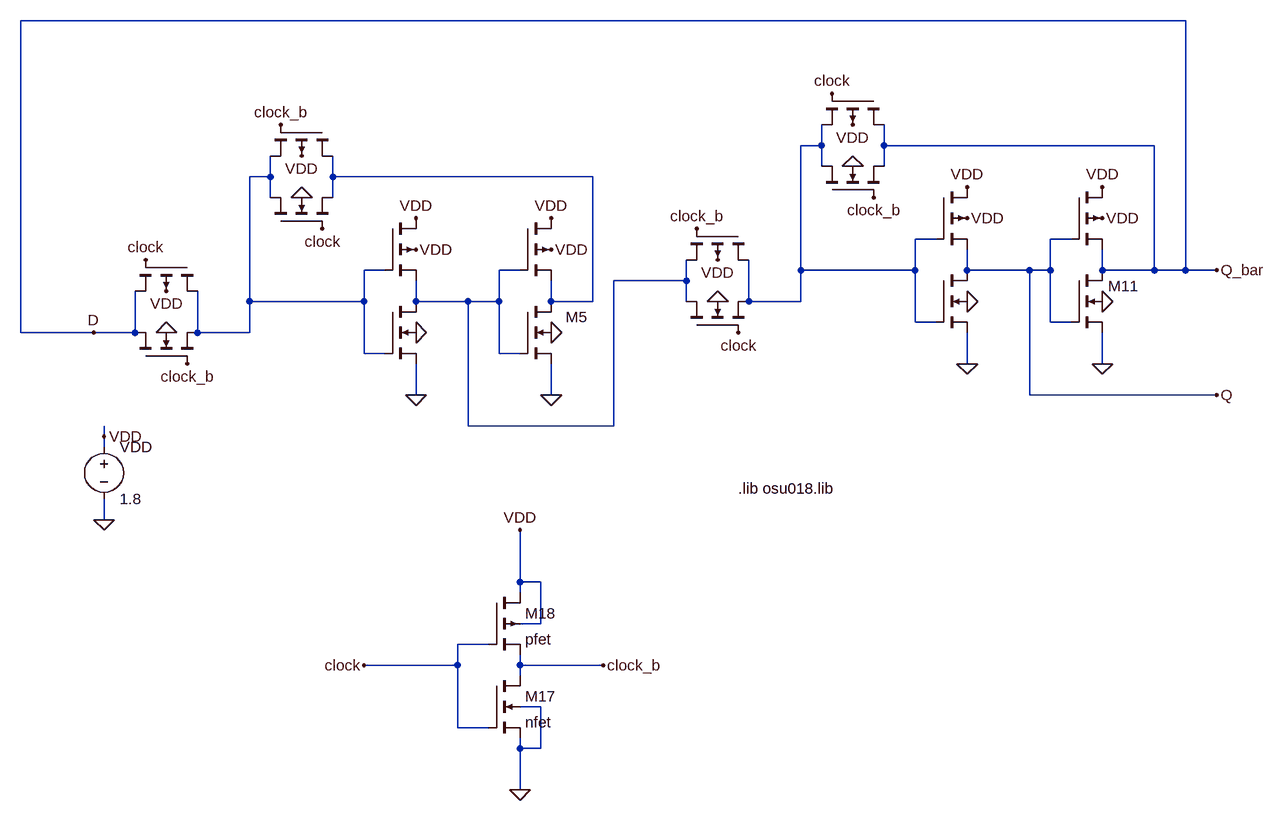
[diagram p0: schematic freq_div_2.asc]
freq_div_2.asc, the LTspice schematic file:
Version 4
SHEET 1 1824 680
WIRE 1680 -880 -112 -880
WIRE 1120 -688 1120 -720
WIRE 1120 -688 1088 -688
WIRE 1216 -688 1216 -720
WIRE 1632 -688 1216 -688
WIRE 1120 -656 1120 -688
WIRE 1216 -656 1216 -688
WIRE 272 -640 272 -672
WIRE 272 -640 240 -640
WIRE 368 -640 368 -672
WIRE 768 -640 368 -640
WIRE 272 -608 272 -640
WIRE 368 -608 368 -640
WIRE 1296 -544 1264 -544
WIRE 1504 -544 1472 -544
WIRE 448 -496 416 -496
WIRE 656 -496 624 -496
WIRE 1088 -496 1088 -688
WIRE 1264 -496 1264 -544
WIRE 1264 -496 1088 -496
WIRE 1344 -496 1344 -528
WIRE 1440 -496 1344 -496
WIRE 1472 -496 1472 -544
WIRE 1472 -496 1440 -496
WIRE 1552 -496 1552 -528
WIRE 1632 -496 1632 -688
WIRE 1632 -496 1552 -496
WIRE 1680 -496 1680 -880
WIRE 1680 -496 1632 -496
WIRE 1728 -496 1680 -496
WIRE 912 -480 912 -512
WIRE 912 -480 800 -480
WIRE 240 -448 240 -640
WIRE 416 -448 416 -496
WIRE 416 -448 240 -448
WIRE 496 -448 496 -480
WIRE 576 -448 496 -448
WIRE 624 -448 624 -496
WIRE 624 -448 576 -448
WIRE 704 -448 704 -480
WIRE 768 -448 768 -640
WIRE 768 -448 704 -448
WIRE 912 -448 912 -480
WIRE 1008 -448 1008 -512
WIRE 1088 -448 1088 -496
WIRE 1088 -448 1008 -448
WIRE 1264 -416 1264 -496
WIRE 1296 -416 1264 -416
WIRE 1472 -416 1472 -496
WIRE 1504 -416 1472 -416
WIRE -112 -400 -112 -880
WIRE 0 -400 -112 -400
WIRE 64 -400 64 -464
WIRE 64 -400 0 -400
WIRE 160 -400 160 -464
WIRE 240 -400 240 -448
WIRE 240 -400 160 -400
WIRE 416 -368 416 -448
WIRE 448 -368 416 -368
WIRE 624 -368 624 -448
WIRE 656 -368 624 -368
WIRE 1344 -352 1344 -400
WIRE 1552 -352 1552 -400
WIRE 496 -304 496 -352
WIRE 704 -304 704 -352
WIRE 1440 -304 1440 -496
WIRE 1728 -304 1440 -304
WIRE 576 -256 576 -448
WIRE 800 -256 800 -480
WIRE 800 -256 576 -256
WIRE 16 -240 16 -256
WIRE 16 -224 16 -240
WIRE 16 -112 16 -144
WIRE 656 -16 656 -96
WIRE 688 -16 656 -16
WIRE 656 0 656 -16
WIRE 688 48 688 -16
WIRE 688 48 656 48
WIRE 608 80 560 80
WIRE 560 112 560 80
WIRE 560 112 416 112
WIRE 656 112 656 96
WIRE 784 112 656 112
WIRE 656 128 656 112
WIRE 688 176 656 176
WIRE 560 208 560 112
WIRE 608 208 560 208
WIRE 656 240 656 224
WIRE 688 240 688 176
WIRE 688 240 656 240
WIRE 656 304 656 240
FLAG 496 -400 0
FLAG 16 -112 0
FLAG 16 -240 VDD
FLAG 496 -528 VDD
FLAG 496 -304 0
FLAG 496 -576 VDD
FLAG 704 -400 0
FLAG 704 -528 VDD
FLAG 704 -304 0
FLAG 704 -576 VDD
FLAG 112 -400 0
FLAG 0 -400 D
FLAG 144 -352 clock_b
FLAG 784 112 clock_b
FLAG 416 112 clock
FLAG 112 -464 VDD
FLAG 80 -512 clock
FLAG 320 -608 0
FLAG 352 -560 clock
FLAG 320 -672 VDD
FLAG 288 -720 clock_b
FLAG 1344 -448 0
FLAG 1344 -576 VDD
FLAG 1344 -352 0
FLAG 1344 -624 VDD
FLAG 1552 -448 0
FLAG 1552 -576 VDD
FLAG 1552 -352 0
FLAG 1552 -624 VDD
FLAG 960 -448 0
FLAG 992 -400 clock
FLAG 1728 -496 Q_bar
FLAG 1728 -304 Q
FLAG 960 -512 VDD
FLAG 928 -560 clock_b
FLAG 1168 -656 0
FLAG 1200 -608 clock_b
FLAG 1168 -720 VDD
FLAG 1136 -768 clock
FLAG 656 304 0
FLAG 656 -96 VDD
SYMBOL nmos4 448 -448 R0
WINDOW 0 104 24 Invisible 2
WINDOW 3 179 41 Invisible 2
SYMATTR InstName M1
SYMATTR Value nfet
SYMATTR Value2 l=180n w=180n
SYMBOL voltage 16 -240 R0
WINDOW 123 0 0 Left 2
WINDOW 39 0 0 Left 2
SYMATTR InstName VDD
SYMATTR Value 1.8
SYMBOL pmos4 448 -576 R0
WINDOW 0 88 9 Invisible 2
WINDOW 3 168 20 Invisible 2
SYMATTR InstName M2
SYMATTR Value pfet
SYMATTR Value2 l=180n w=540n
SYMBOL nmos4 656 -448 R0
WINDOW 0 104 24 Right 2
WINDOW 3 179 41 Invisible 2
SYMATTR InstName M5
SYMATTR Value nfet
SYMATTR Value2 l=180n w=180n
SYMBOL pmos4 656 -576 R0
WINDOW 0 88 9 Invisible 2
WINDOW 3 168 20 Invisible 2
SYMATTR InstName M6
SYMATTR Value pfet
SYMATTR Value2 l=180n w=540n
SYMBOL nmos4 64 -352 R270
WINDOW 0 86 42 Invisible 2
WINDOW 3 82 140 Invisible 2
SYMATTR InstName M7
SYMATTR Value nfet
SYMATTR Value2 l=180n w=180n
SYMBOL pmos4 160 -512 R90
WINDOW 0 71 26 Invisible 2
WINDOW 3 75 133 Invisible 2
SYMATTR InstName M3
SYMATTR Value pfet
SYMATTR Value2 l=180n w=540n
SYMBOL nmos4 272 -560 R270
WINDOW 0 86 42 Invisible 2
WINDOW 3 82 140 Invisible 2
SYMATTR InstName M4
SYMATTR Value nfet
SYMATTR Value2 l=180n w=180n
SYMBOL pmos4 368 -720 R90
WINDOW 0 71 26 Invisible 2
WINDOW 3 75 133 Invisible 2
SYMATTR InstName M8
SYMATTR Value pfet
SYMATTR Value2 l=180n w=540n
SYMBOL nmos4 1296 -496 R0
WINDOW 0 104 24 Invisible 2
WINDOW 3 179 41 Invisible 2
SYMATTR InstName M9
SYMATTR Value nfet
SYMATTR Value2 l=180n w=180n
SYMBOL pmos4 1296 -624 R0
WINDOW 0 88 9 Invisible 2
WINDOW 3 168 20 Invisible 2
SYMATTR InstName M10
SYMATTR Value pfet
SYMATTR Value2 l=180n w=540n
SYMBOL nmos4 1504 -496 R0
WINDOW 0 104 24 Right 2
WINDOW 3 179 41 Invisible 2
SYMATTR InstName M11
SYMATTR Value nfet
SYMATTR Value2 l=180n w=180n
SYMBOL pmos4 1504 -624 R0
WINDOW 0 88 9 Invisible 2
WINDOW 3 168 20 Invisible 2
SYMATTR InstName M12
SYMATTR Value pfet
SYMATTR Value2 l=180n w=540n
SYMBOL nmos4 912 -400 R270
WINDOW 0 86 42 Invisible 2
WINDOW 3 82 140 Invisible 2
SYMATTR InstName M13
SYMATTR Value nfet
SYMATTR Value2 l=180n w=180n
SYMBOL pmos4 1008 -560 R90
WINDOW 0 71 26 Invisible 2
WINDOW 3 75 133 Invisible 2
SYMATTR InstName M14
SYMATTR Value pfet
SYMATTR Value2 l=180n w=540n
SYMBOL nmos4 1120 -608 R270
WINDOW 0 86 42 Invisible 2
WINDOW 3 82 140 Invisible 2
SYMATTR InstName M15
SYMATTR Value nfet
SYMATTR Value2 l=180n w=180n
SYMBOL pmos4 1216 -768 R90
WINDOW 0 71 26 Invisible 2
WINDOW 3 75 133 Invisible 2
SYMATTR InstName M16
SYMATTR Value pfet
SYMATTR Value2 l=180n w=540n
SYMBOL nmos4 608 128 R0
SYMATTR InstName M17
SYMATTR Value nfet
SYMATTR Value2 l=180n w=180n
SYMBOL pmos4 608 0 R0
SYMATTR InstName M18
SYMATTR Value pfet
SYMATTR Value2 l=180n w=540n
TEXT 992 -160 Left 2 !.lib osu018.lib

The netlist it stands for:
* freq_div_2.asc
M1 N004 N002 0 0 nfet l=180n w=180n
VDD VDD 0 1.8
M2 VDD N002 N004 VDD pfet l=180n w=540n
M5 N003 N004 0 0 nfet l=180n w=180n
M6 VDD N004 N003 VDD pfet l=180n w=540n
M7 Q_bar clock_b N002 0 nfet l=180n w=180n
M3 N002 clock Q_bar VDD pfet l=180n w=540n
M4 N002 clock N003 0 nfet l=180n w=180n
M8 N003 clock_b N002 VDD pfet l=180n w=540n
M9 Q N001 0 0 nfet l=180n w=180n
M10 VDD N001 Q VDD pfet l=180n w=540n
M11 Q_bar Q 0 0 nfet l=180n w=180n
M12 VDD Q Q_bar VDD pfet l=180n w=540n
M13 N004 clock N001 0 nfet l=180n w=180n
M14 N001 clock_b N004 VDD pfet l=180n w=540n
M15 N001 clock_b Q_bar 0 nfet l=180n w=180n
M16 Q_bar clock N001 VDD pfet l=180n w=540n
M17 clock_b clock 0 0 nfet l=180n w=180n
M18 VDD clock clock_b VDD pfet l=180n w=540n
.model NMOS NMOS
.model PMOS PMOS
.lib standard.mos
.lib osu018.lib
.backanno
.end